# EAGLE design fuenteSimetrica (EAGLE 7.5.0)
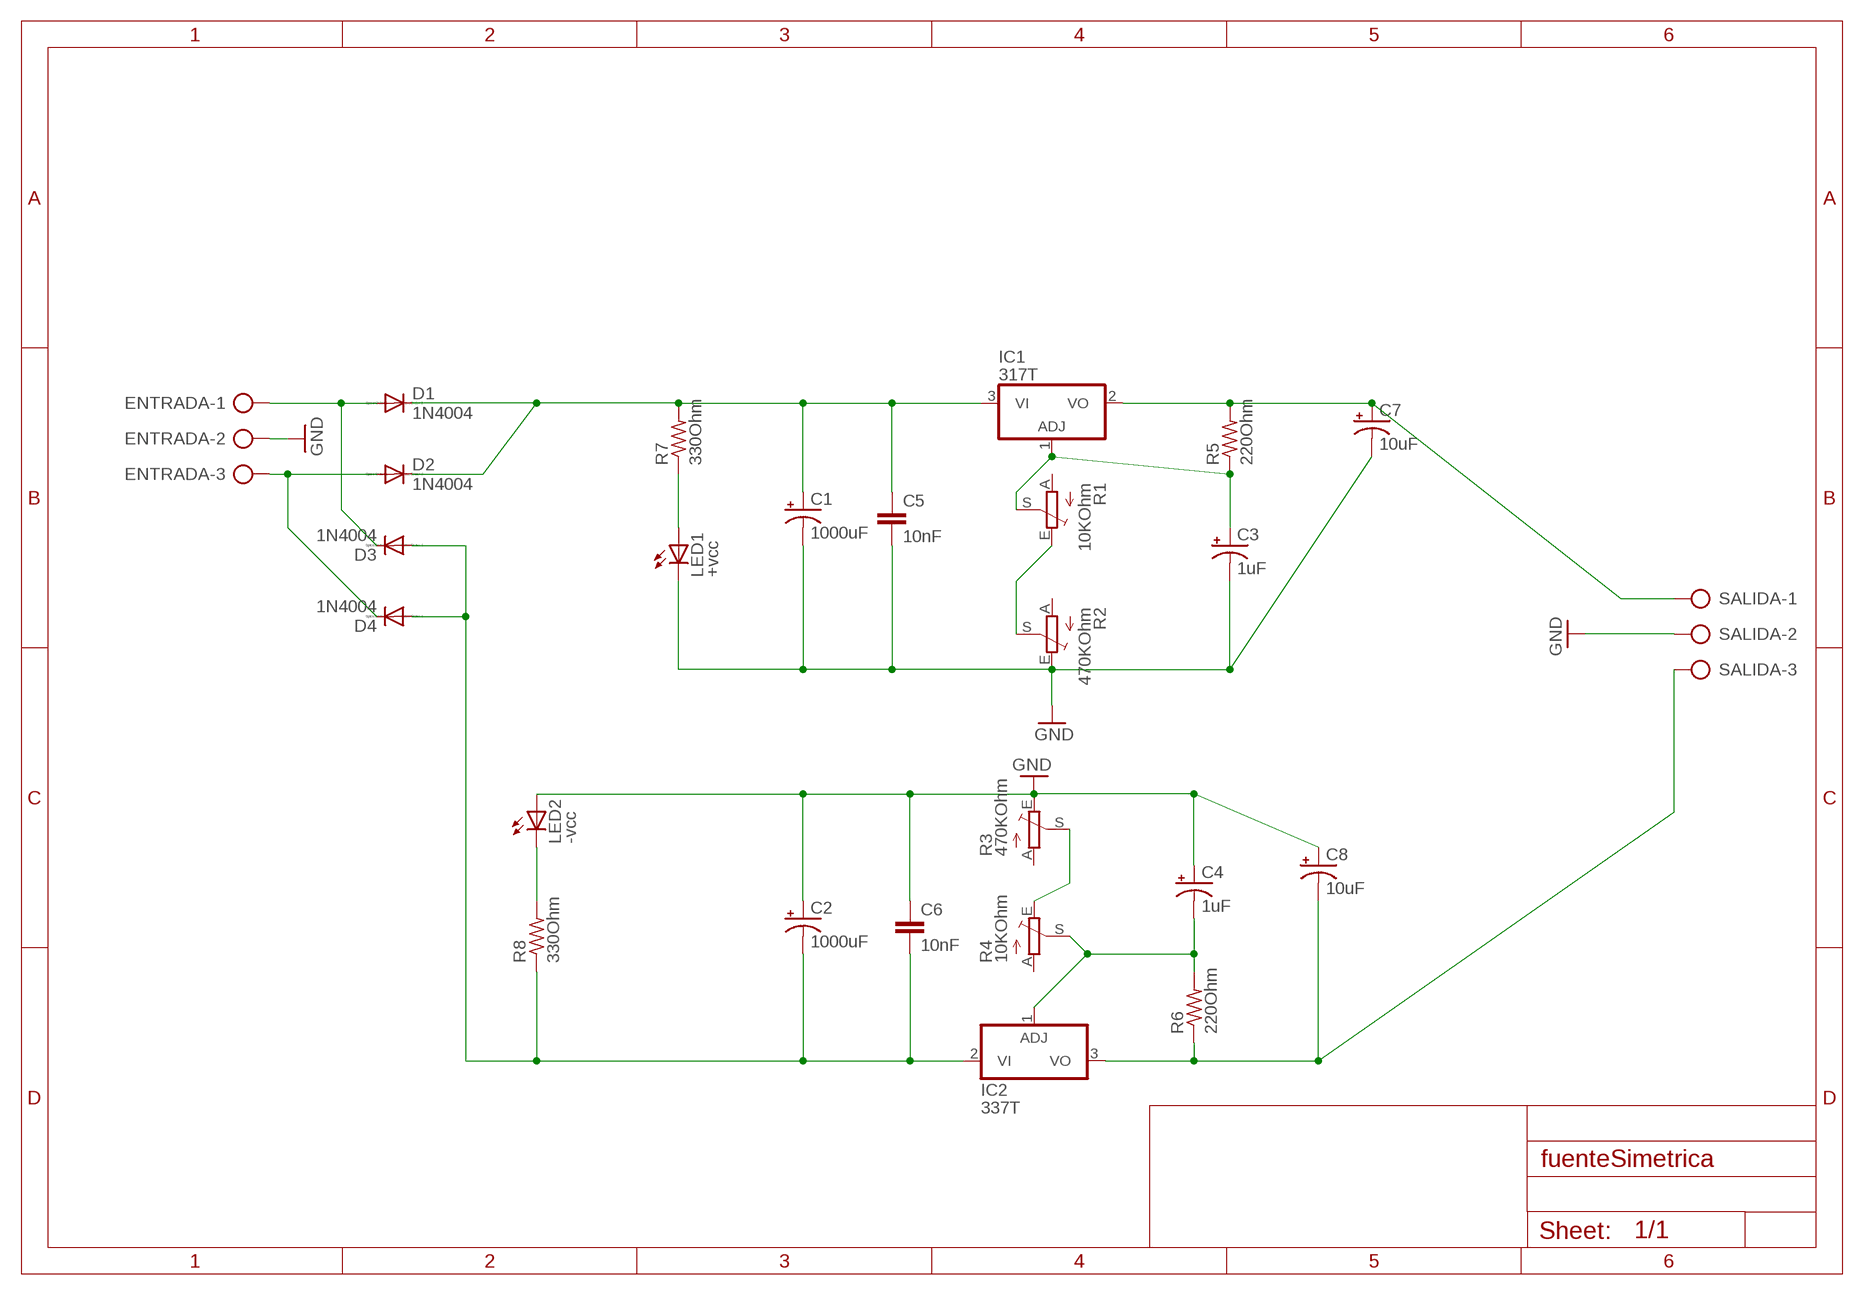
[diagram p0: schematic, sheet 1]

## Parts
C1  1000uF  CPOL-USE3.5-8  [E3,5-8]
C2  1000uF  CPOL-USE3.5-8  [E3,5-8]
C3  1uF  CPOL-USE2.5-6  [E2,5-6]
C4  1uF  CPOL-USE2.5-6  [E2,5-6]
C5  10nF  C-EU050-030X075  [C050-030X075]
C6  10nF  C-EU050-030X075  [C050-030X075]
C7  10uF  CPOL-USE2.5-6  [E2,5-6]
C8  10uF  CPOL-USE2.5-6  [E2,5-6]
D1  1N4004  [DO41-10]
D2  1N4004  [DO41-10]
D3  1N4004  [DO41-10]
D4  1N4004  [DO41-10]
ENTRADA  AK500/3-H  [AK500/3-H]
IC1  317T  [TO220H]
IC2  337T  [TO220H]
LED1  +vcc  LED5MM  [LED5MM]
LED2  -vcc  LED5MM  [LED5MM]
R1  10KOhm  TRIM_EU-RS3  [RS3]
R2  470KOhm  TRIM_EU-RS3  [RS3]
R3  470KOhm  TRIM_EU-RS3  [RS3]
R4  10KOhm  TRIM_EU-RS3  [RS3]
R5  220Ohm  R-US_0207/10  [0207/10]
R6  220Ohm  R-US_0207/10  [0207/10]
R7  330Ohm  R-US_0207/10  [0207/10]
R8  330Ohm  R-US_0207/10  [0207/10]
SALIDA  AK500/3-H  [AK500/3-H]

## Nets
GND: C1.- C2.+ C3.- C4.+ C5.2 C6.1 C7.- C8.+ ENTRADA.2 LED1.K(C) LED2.A R2.E R3.E SALIDA.2
N$1: D1.A D3.C ENTRADA.1
N$2: C1.+ C5.1 D1.C D2.C IC1.3(VI) R7.2
N$3: D2.A D4.C ENTRADA.3
N$4: LED1.A R7.1
N$5: C7.+ IC1.2(VO) R5.2 SALIDA.1
N$7: R1.E R2.S
N$8: LED2.K(C) R8.2
N$9: C3.+ IC1.1(ADJ) R1.S R5.1
N$10: C4.- IC2.1(ADJ) R4.S R6.2
N$11: R3.S R4.E
N$12: C8.- IC2.3(VO) R6.1 SALIDA.3
N$13: C2.- C6.2 D3.A D4.A IC2.2(VI) R8.1
Unconnected: R1.A R2.A R3.A R4.A

## Library data of the parts
C1-C4 C7 C8 = rcl:CPOL-US: POLARIZED CAPACITOR, American symbol
C5 C6 = rcl:C-EU: CAPACITOR, European symbol
D1-D4 = diode:1N4004: DIODE general purpose rectifier, 1 A
ENTRADA SALIDA = con-ptr500:AK500/3-H: CONNECTOR Aug. 2004 / PTR Meßtechnik: Die Bezeichnung der Serie AK505 wurde geändert. Es handelt sich hierbei um AK500 in horizontaler Ausführung.; OC_FARNELL: unknown; OC_NEWARK: unknown
IC1 = linear:*317: Positive VOLTAGE REGULATOR
IC2 = linear:*337: Negative VOLTAGE REGULATOR
LED1 LED2 = led:LED: LED OSRAM: - CHIPLED LG R971, LG N971, LY N971, LG Q971, LY Q971, LO R971, LY R971 LH N974, LH R974 LS Q976, LO Q976, LY Q976 LO Q996 - Hyper CHIPLED LW Q18S LB Q993, LB Q99A, LB R99A - SideLED LS A670, LO A670, LY A670, LG A670, LP A670 LB A673, LV A673, LT A673, LW A673 LH A674 LY A675 LS A676, LA A676, LO A676, LY A676, LW A676 LS A679, LY A679, LG A679 - Hyper Micro SIDELED® LS Y876, LA Y876, LO Y876, LY Y876 LT Y87S - SmartLED LW L88C, LW L88S LB L89C, LB L89S, LG L890 LS L89K, LO L89K, LY L89K LS L896, LA L896, LO L896, LY L896 - TOPLED LS T670, LO T670, LY T670, LG T670, LP T670 LSG T670, LSP T670, LSY T670, LOP T670, LYG T670 LG T671, LOG T671, LSG T671 LB T673, LV T673, LT T673, LW T673 LH T674 LS T676, LA T676, LO T676, LY T676, LB T676, LH T676, LSB T676, LW T676 LB T67C, LV T67C, LT T67C, LS T67K, LO T67K, LY T67K, LW E67C LS E67B, LA E67B, LO E67B, LY E67B, LB E67C, LV E67C, LT E67C LW T67C LS T679, LY T679, LG T679 LS T770, LO T770, LY T770, LG T770, LP T770 LB T773, LV T773, LT T773, LW T773 LH T774 LS E675, LA E675, LY E675, LS T675 LS T776, LA T776, LO T776, LY T776, LB T776 LHGB T686 LT T68C, LB T68C - Hyper Mini TOPLED® LB M676 - Mini TOPLED Santana® LG M470 LS M47K, LO M47K, LY M47K Source: http://www.osram.convergy.de LUXEON: - LUMILED® LXK2-PW12-R00, LXK2-PW12-S00, LXK2-PW14-U00, LXK2-PW14-V00 LXK2-PM12-R00, LXK2-PM12-S00, LXK2-PM14-U00 LXK2-PE12-Q00, LXK2-PE12-R00, LXK2-PE12-S00, LXK2-PE14-T00, LXK2-PE14-U00 LXK2-PB12-K00, LXK2-PB12-L00, LXK2-PB12-M00, LXK2-PB14-N00, LXK2-PB14-P00, LXK2-PB14-Q00 LXK2-PR12-L00, LXK2-PR12-M00, LXK2-PR14-Q00, LXK2-PR14-R00 LXK2-PD12-Q00, LXK2-PD12-R00, LXK2-PD12-S00 LXK2-PH12-R00, LXK2-PH12-S00 LXK2-PL12-P00, LXK2-PL12-Q00, LXK2-PL12-R00 Source: www.luxeon.com KINGBRIGHT: KA-3528ASYC Source: www.kingbright.com
R1-R4 = pot:TRIM_EU-: POTENTIOMETER
R5-R8 = rcl:R-US_: RESISTOR, American symbol

## Net classes
0 fina: width 0.508 mm
1 mediana: width 1.27 mm
2 gruesa: width 2.54 mm

## Board
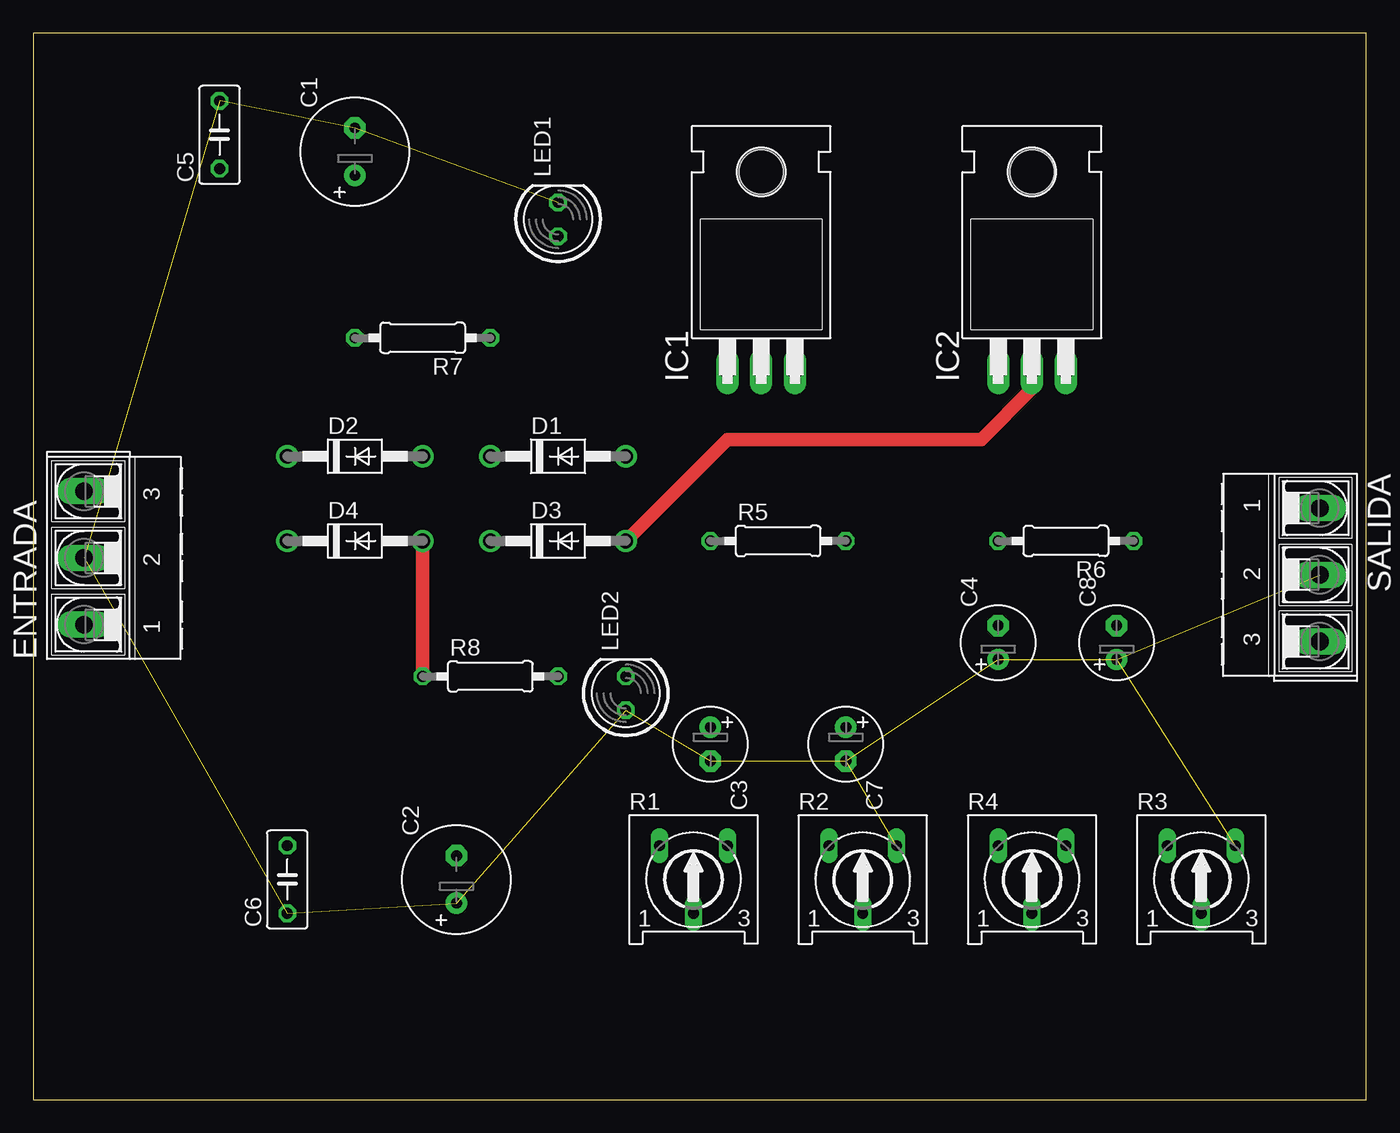
[diagram p1: board, top side]
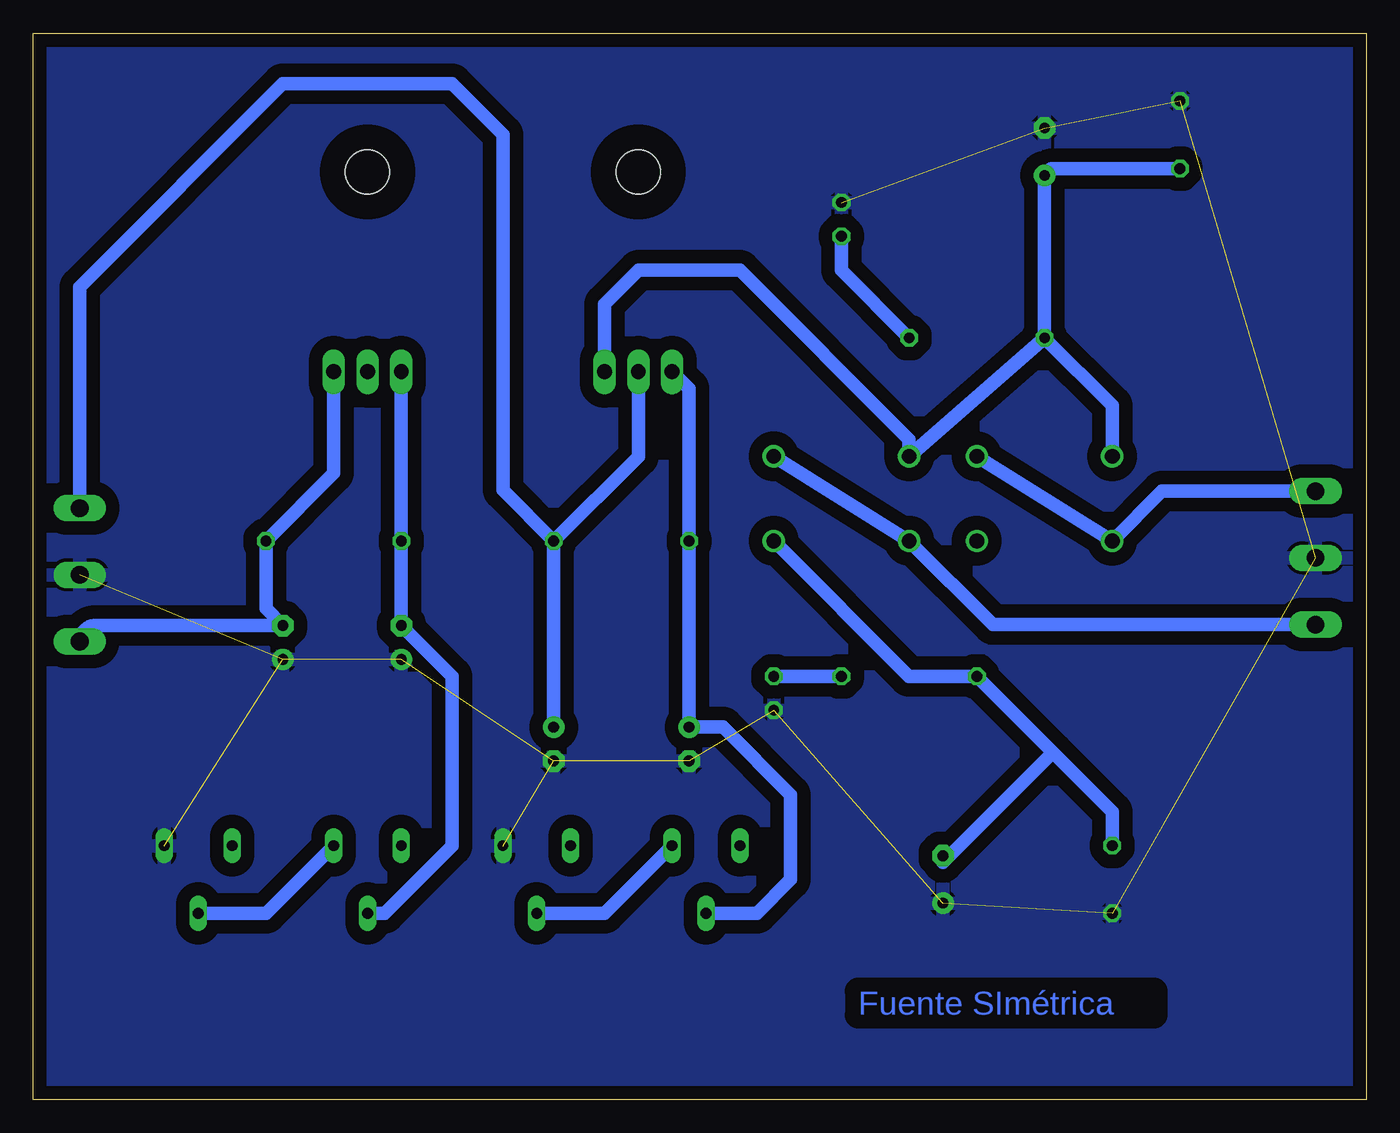
[diagram p2: board, bottom side, seen from below]

Size 100 x 80 mm. Coordinates in mm from the lower left corner, seen from the top.
Outline: 0,0 100,0 100,80 0,80 0,0
Copper layers (1*16): Top 0.035mm / dielectric 1.5mm / Bottom 0.035mm
Design rules "reglas_fuente": minimum track width 40mil, minimum drill 24mil, track to track 15mil, track to pad 15mil, pad to pad 15mil, via to via 15mil, smd to smd 8mil, copper to edge 40mil, drill to drill 8mil, minimum pad ring 10mil, minimum via ring 8mil, stop-mask expansion 4mil, vias tented up to drill 0mil, thermal gap 10mil

### Footprints (pad centres in the part's own frame; a part is rotated, then mirrored left to right if it is on the bottom)
E3,5-8 = drill 0.813 pad 1.6: + -1.778,0 | drill 0.813 pad 1.6 octagon: - 1.778,0
E2,5-6 = drill 0.813 pad 1.6: + -1.27,0 | drill 0.813 pad 1.6 octagon: - 1.27,0
C050-030X075 = drill 0.813 octagon: 1 -2.54,0; 2 2.54,0
DO41-10 = drill 1.118: A 5.08,0; C -5.08,0
AK500/3-H = drill 1.321 long: 1 -5.004,0; 2 0,0; 3 5.004,0
TO220H = drill 1.118 long: 1 -2.54,-10.16; 2 0,-10.16; 3 2.54,-10.16 | hole 3.302: 0,4.826
LED5MM = drill 0.813 octagon: A -1.27,0; K 1.27,0
RS3 = drill 0.813 long: A -2.54,2.54; E 2.54,2.54; S 0,-2.54
0207/10 = drill 0.813 octagon: 1 -5.08,0; 2 5.08,0

### Placement (x,y rotation side)
C1  24.13,71.12 90 top
C2  31.75,16.51 90 top
C3  50.8,26.67 270 top
C4  72.39,34.29 90 top
C5  13.97,72.39 90 top
C6  19.05,16.51 90 top
C7  60.96,26.67 270 top
C8  81.28,34.29 90 top
D1  39.37,48.26 0 top
D2  24.13,48.26 0 top
D3  39.37,41.91 0 top
D4  24.13,41.91 0 top
ENTRADA  3.81,40.64 90 top
IC1  54.61,64.77 0 top
IC2  74.93,64.77 0 top
LED1  39.37,66.04 90 top
LED2  44.45,30.48 90 top
R1  49.53,16.51 0 top
R2  62.23,16.51 0 top
R3  87.63,16.51 0 top
R4  74.93,16.51 0 top
R5  55.88,41.91 0 top
R6  77.47,41.91 180 top
R7  29.21,57.15 180 top
R8  34.29,31.75 0 top
SALIDA  96.52,39.37 270 top

### Tracks (layer width: path | path; a pad name or v marks a point on that pad's centre or on a via)
GND  (13 unrouted)
  pour Bottom (isolate 1.016): 0,80.01 100.33,80.01 100.33,0 0,0
N$1
  Bottom 1.016: D1.A D3.C 28.02,35.64 ENTRADA.1
N$2
  Bottom 1.016: C5.1 23.62,69.85 C1.+ R7.2 | R7.2 19.05,52.07 D2.C | R7.2 D1.C 34.29,49.53 46.99,62.23 54.61,62.23 57.15,59.69 IC1.3
N$3
  Bottom 1.016: ENTRADA.3 15.32,45.64 D4.C D2.A
N$4
  Bottom 1.016: R7.1 39.37,62.23 LED1.A
N$5
  Bottom 1.016: IC1.2 54.61,48.26 R5.2 | SALIDA.1 96.52,60.96 81.28,76.2 68.58,76.2 64.77,72.39 64.77,45.72 R5.2 | R5.2 C7.+
N$7
  Bottom 1.016: R1.E 57.15,13.97 R2.S
N$8
  Bottom 1.016: R8.2 LED2.K
N$9
  Bottom 1.016: IC1.1 50.8,53.34 R5.1 C3.+ 48.26,27.94 43.18,22.86 43.18,16.51 45.72,13.97 R1.S
N$10
  Bottom 1.016: IC2.1 R6.2 C4.- 68.58,31.75 68.58,19.05 73.66,13.97 R4.S
N$11
  Bottom 1.016: R3.S 82.55,13.97 R4.E
N$12
  Bottom 1.016: IC2.3 77.47,46.99 R6.1 82.55,36.83 C8.- 95.33,35.56 arc-90 SALIDA.3
N$13
  Top 1.016: D4.A R8.1 | D3.A 52.07,49.53 71.12,49.53 74.93,53.34 IC2.2
  Bottom 1.016: C6.2 19.05,21.59 23.5,26.04 | 23.5,26.04 R8.1 34.29,31.75 D3.A | C2.- 31.75,17.78 23.5,26.04

### Text on the board
Bottom: Fuente SImétrica